# Altium project BLE_tag_highpower.PrjPcb
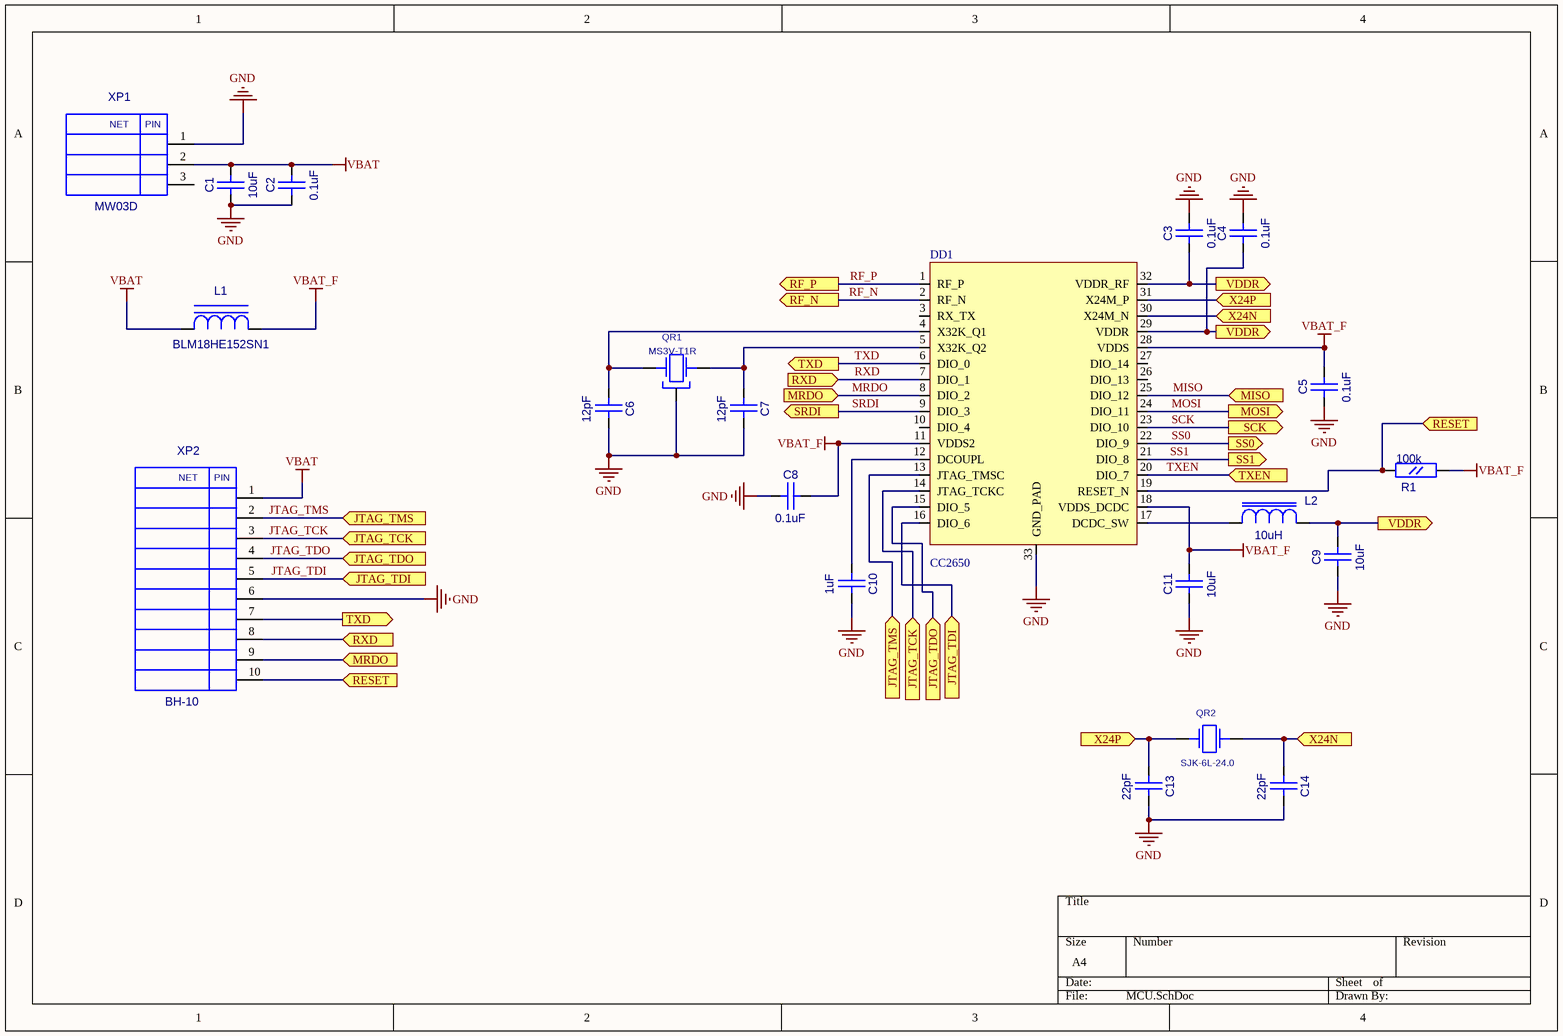
[diagram p0: MCU.SchDoc]
2 sheets, 43 parts. Net scope: flat (ports and power ports of the same name join across sheets).
Board file: BLE_tag_highpower.PcbDoc
Sheets:
  MCU.SchDoc
  RF.SchDoc

## Sheet MCU.SchDoc
size A4

### Parts
C1  10uF  [CC0805]
C2  0.1uF  [CC0603]
C3  0.1uF  [CC0603]
C4  0.1uF  [CC0603]
C5  0.1uF  [CC0603]
C6  12pF  [CC0603]
C7  12pF  [CC0603]
C8  0.1uF  [CC0603]
C9  10uF  [CC0805]
C10  1uF  [CC0603]
C11  10uF  [CC0805]
C13  22pF  [CC0603]
C14  22pF  [CC0603]
DD1  CC2650  [QFN32_TI]
L1  BLM18HE152SN1  [L0603]
L2  10uH  [RC0805]
QR1  MS3V-T1R  [MS3V-T1R]
QR2  SJK-6L-24.0  [AC5032_2]
R1  100k  [RC0603]
XP1  MW03D  [MW03D]
XP2  BH-10  [BH-10]

### Ports
JTAG_TCK (in), JTAG_TDI (in), JTAG_TDO (in), JTAG_TMS (in), MISO (in), MOSI (out), MRDO (in), RESET (in), RF_N (out), RF_P (out), RXD (in), SCK (out), SRDI (out), SS0 (out), SS1 (out), TXD (out), TXEN (in), VDDR (out), X24N (in), X24P (in)

### Nets
GND: C1.1(A) C2.1(A) C3.2(B) C4.2(B) C5.1(A) C6.2(B) C7.2(B) C8.1(A) C9.1(A) C10.2(B) C11.1(A) C13.2(B) C14.2(B) DD1.33(GND_PAD) QR1.3 XP1.1 XP2.6
VBAT: C1.2(B) C2.2(B) L1.1(A) XP1.2 XP2.1
VBAT_F: C5.2(B) C8.2(B) C11.2(B) DD1.11(VDDS2) DD1.18(VDDS_DCDC) DD1.28(VDDS) L1.2(C) R1.1(A)
JTAG_TCK: DD1.14(JTAG_TCKC) XP2.3 ; port JTAG_TCK
JTAG_TDI: DD1.16(DIO_6) XP2.5 ; port JTAG_TDI
JTAG_TDO: DD1.15(DIO_5) XP2.4 ; port JTAG_TDO
JTAG_TMS: DD1.13(JTAG_TMSC) XP2.2 ; port JTAG_TMS
MISO: DD1.25(DIO_12) ; port MISO
MOSI: DD1.24(DIO_11) ; port MOSI
MRDO: DD1.8(DIO_2) XP2.9 ; port MRDO
RF_N: DD1.2(RF_N) ; port RF_N
RF_P: DD1.1(RF_P) ; port RF_P
RXD: DD1.7(DIO_1) XP2.8 ; port RXD
SCK: DD1.23(DIO_10) ; port SCK
SRDI: DD1.9(DIO_3) ; port SRDI
SS0: DD1.22(DIO_9) ; port SS0
SS1: DD1.21(DIO_8) ; port SS1
TXD: DD1.6(DIO_0) XP2.7 ; port TXD
TXEN: DD1.20(DIO_7) ; port TXEN
NetC3_1: C3.1(A) C4.1(A) C9.2(B) DD1.29(VDDR) DD1.32(VDDR_RF) L2.2(B) ; port VDDR
NetC6_1: C6.1(A) DD1.4(X32K_Q1) QR1.2(X2)
NetC7_1: C7.1(A) DD1.5(X32K_Q2) QR1.1(X1)
NetC10_1: C10.1(A) DD1.12(DCOUPL)
NetC13_1: C13.1(A) DD1.31(X24M_P) QR2.1 ; port X24P
NetC14_1: C14.1(A) DD1.30(X24M_N) QR2.2 ; port X24N
NetDD1_17: DD1.17(DCDC_SW) L2.1(A)
NetDD1_19: DD1.19(RESET_N) R1.2(B) XP2.10 ; port RESET

Not connected (* = marked no-connect by the designer): DD1 3(RX_TX) 10(DIO_4) 26(DIO_13) 27(DIO_14); XP1 3

### Notes on the sheet
- (in symbol BH-10) NET; PIN
- (in symbol MW03D) NET; PIN

### Library data of the parts
C1 C9 C11 = CC0805: Value: 10uF
C2-C8 C10 C13 C14 = CC0603
  C2-C5 C8: Value: 0.1uF
  C6 C7: Value: 12pF
  C10: Value: 1uF
  C13 C14: Value: 22pF
DD1 = CC2650RHB: CC2650RHBT; Value: CC2650
L1 = L0603: Value: BLM18HE152SN1
L2 = L0805: Value: 10uH
QR1 = MS3V-T1R: CRYSTAL_32768 Hz; Value: *
QR2 = AC5032_2: AC5032/2; Value: SJK-6L-24.0
R1 = RC0603: Value: 100k
XP1 = MW03D: Value: *
XP2 = BH-10: Value: *

## Sheet RF.SchDoc
size A4
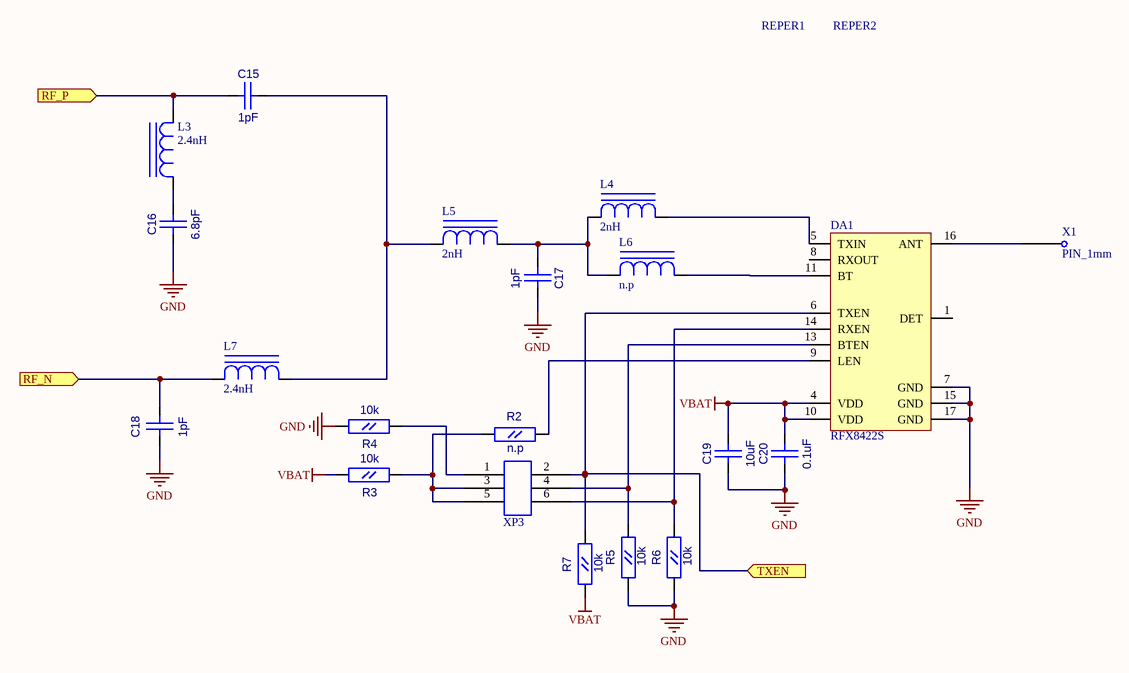
[diagram p1: RF.SchDoc]

### Parts
C15  1pF  [CC0603]
C16  6.8pF  [CC0603]
C17  1pF  [CC0603]
C18  1pF  [CC0603]
C19  10uF  [CC0805]
C20  0.1uF  [CC0603]
DA1  RFX8422S  [QFN-16_Skyworks]
L3  2.4nH  [L0402]
L4  2nH  [L0402]
L5  2nH  [L0402]
L6  n.p  [L0402]
L7  2.4nH  [L0402]
R2  n.p  [RC0603]
R3  10k  [RC0603]
R4  10k  [RC0603]
R5  10k  [RC0603]
R6  10k  [RC0603]
R7  10k  [RC0603]
REPER1  REPER1.2  [REPER1.2]  (value not drawn)
REPER2  REPER1.2  [REPER1.2]  (value not drawn)
X1  PIN_1mm  [PIN_1mm]
XP3  PLD06_SMD  [PLD06_SMD]  (value not drawn)

### Ports
RF_N (in), RF_P (in), TXEN (in)

### Nets
GND: C16.1(A) C17.2(B) C18.2(B) C19.1(A) C20.1(A) DA1.7(GND) DA1.15(GND) DA1.17(GND) R4.2(B) R5.1(A) R6.1(A)
VBAT: C19.2(B) C20.2(B) DA1.4(VDD) DA1.10(VDD) R3.2(B) R7.1(A)
RF_N: C18.1(A) L7.1(A) ; port RF_N
RF_P: C15.2(B) L3.2(C) ; port RF_P
TXEN: DA1.6(TXEN) R7.2(B) XP3.2 ; port TXEN
NetC15_1: C15.1(A) L5.1(A) L7.2(C)
NetC16_2: C16.2(B) L3.1(A)
NetC17_1: C17.1(A) L4.1(A) L5.2(C) L6.1(A)
NetDA1_5: DA1.5(TXIN) L4.2(C)
NetDA1_9: DA1.9(LEN) R2.2(B)
NetDA1_11: DA1.11(BT) L6.2(C)
NetDA1_13: DA1.13(BTEN) R5.2(B) XP3.4
NetDA1_14: DA1.14(RXEN) R6.2(B) XP3.6
NetDA1_16: DA1.16(ANT) X1.1
NetR2_1: R2.1(A) R3.1(A) XP3.3 XP3.5
NetR4_1: R4.1(A) XP3.1

Not connected (* = marked no-connect by the designer): DA1 1(DET) 8(RXOUT); REPER1 1; REPER2 1

### Library data of the parts
C15-C18 C20 = CC0603
  C15 C17 C18: Value: 1pF
  C16: Value: 6.8pF
  C20: Value: 0.1uF
C19 = CC0805: Value: 10uF
L3-L7 = L0402
  L3 L7: Value: 2.4nH
  L4 L5: Value: 2nH
  L6: Value: n.p
R2-R7 = RC0603
  R2: Value: n.p
  R3-R7: Value: 10k
DA1 = RFX8422S: Value: RFX8422S
REPER1 REPER2 = REPER1.2: Value: *
XP3 = PLD06_SMD: Value: PLD06_SMD

## Nets that join several sheets
GND: MCU (17 pins), RF (11 pins)
VBAT: MCU (5 pins), RF (6 pins)
RF_N: MCU (DD1.2), RF (C18.1 L7.1)
RF_P: MCU (DD1.1), RF (C15.2 L3.2)
TXEN: MCU (DD1.20), RF (DA1.6 R7.2 XP3.2)